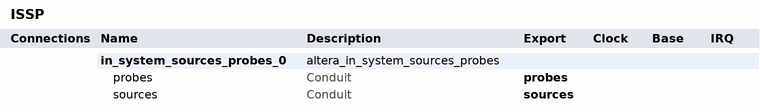
[diagram p0: system contents]
# Platform Designer (Qsys) system ISSP, Arria 10 10AX027H4F34I3SG
# Parameters at their usual value, and those the tool derives, are not listed.
package require -exact qsys 19.2.0
create_system ISSP
set_project_property DEVICE_FAMILY {Arria 10}
set_project_property DEVICE 10AX027H4F34I3SG

add_instance in_system_sources_probes_0 altera_in_system_sources_probes 19.2.0
set_instance_property in_system_sources_probes_0 AUTO_EXPORT true
set_instance_parameter_value in_system_sources_probes_0 create_source_clock false
set_instance_parameter_value in_system_sources_probes_0 instance_id NONE
set_instance_parameter_value in_system_sources_probes_0 probe_width 32
set_instance_parameter_value in_system_sources_probes_0 source_width 32

# exported interfaces
add_interface probes conduit end
set_interface_property probes EXPORT_OF in_system_sources_probes_0.probes
add_interface sources conduit end
set_interface_property sources EXPORT_OF in_system_sources_probes_0.sources

save_system ISSP.qsys
